# Altium schematic sheet Coverpage.SchDoc
size A; SheetNumber: 1; SheetTotal: 2
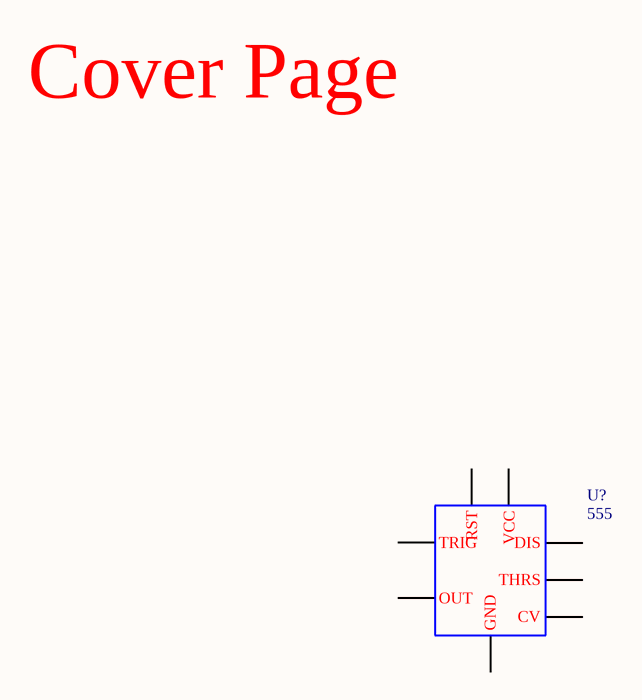
[diagram p0: Coverpage.SchDoc]

## Parts
U?  555

## Nets

Not connected (* = marked no-connect by the designer): U? 1(GND) 2(TRIG) 3(OUT) 4(RST) 5(CV) 6(THRS) 7(DIS) 8(VCC)

## Notes on the sheet
- Cover Page

## Library data of the parts
U? = 555: Timer 555; SimulationGenericComponent: True